# EAGLE design SB (EAGLE 9.6.1)

## Sheet 1 of 2
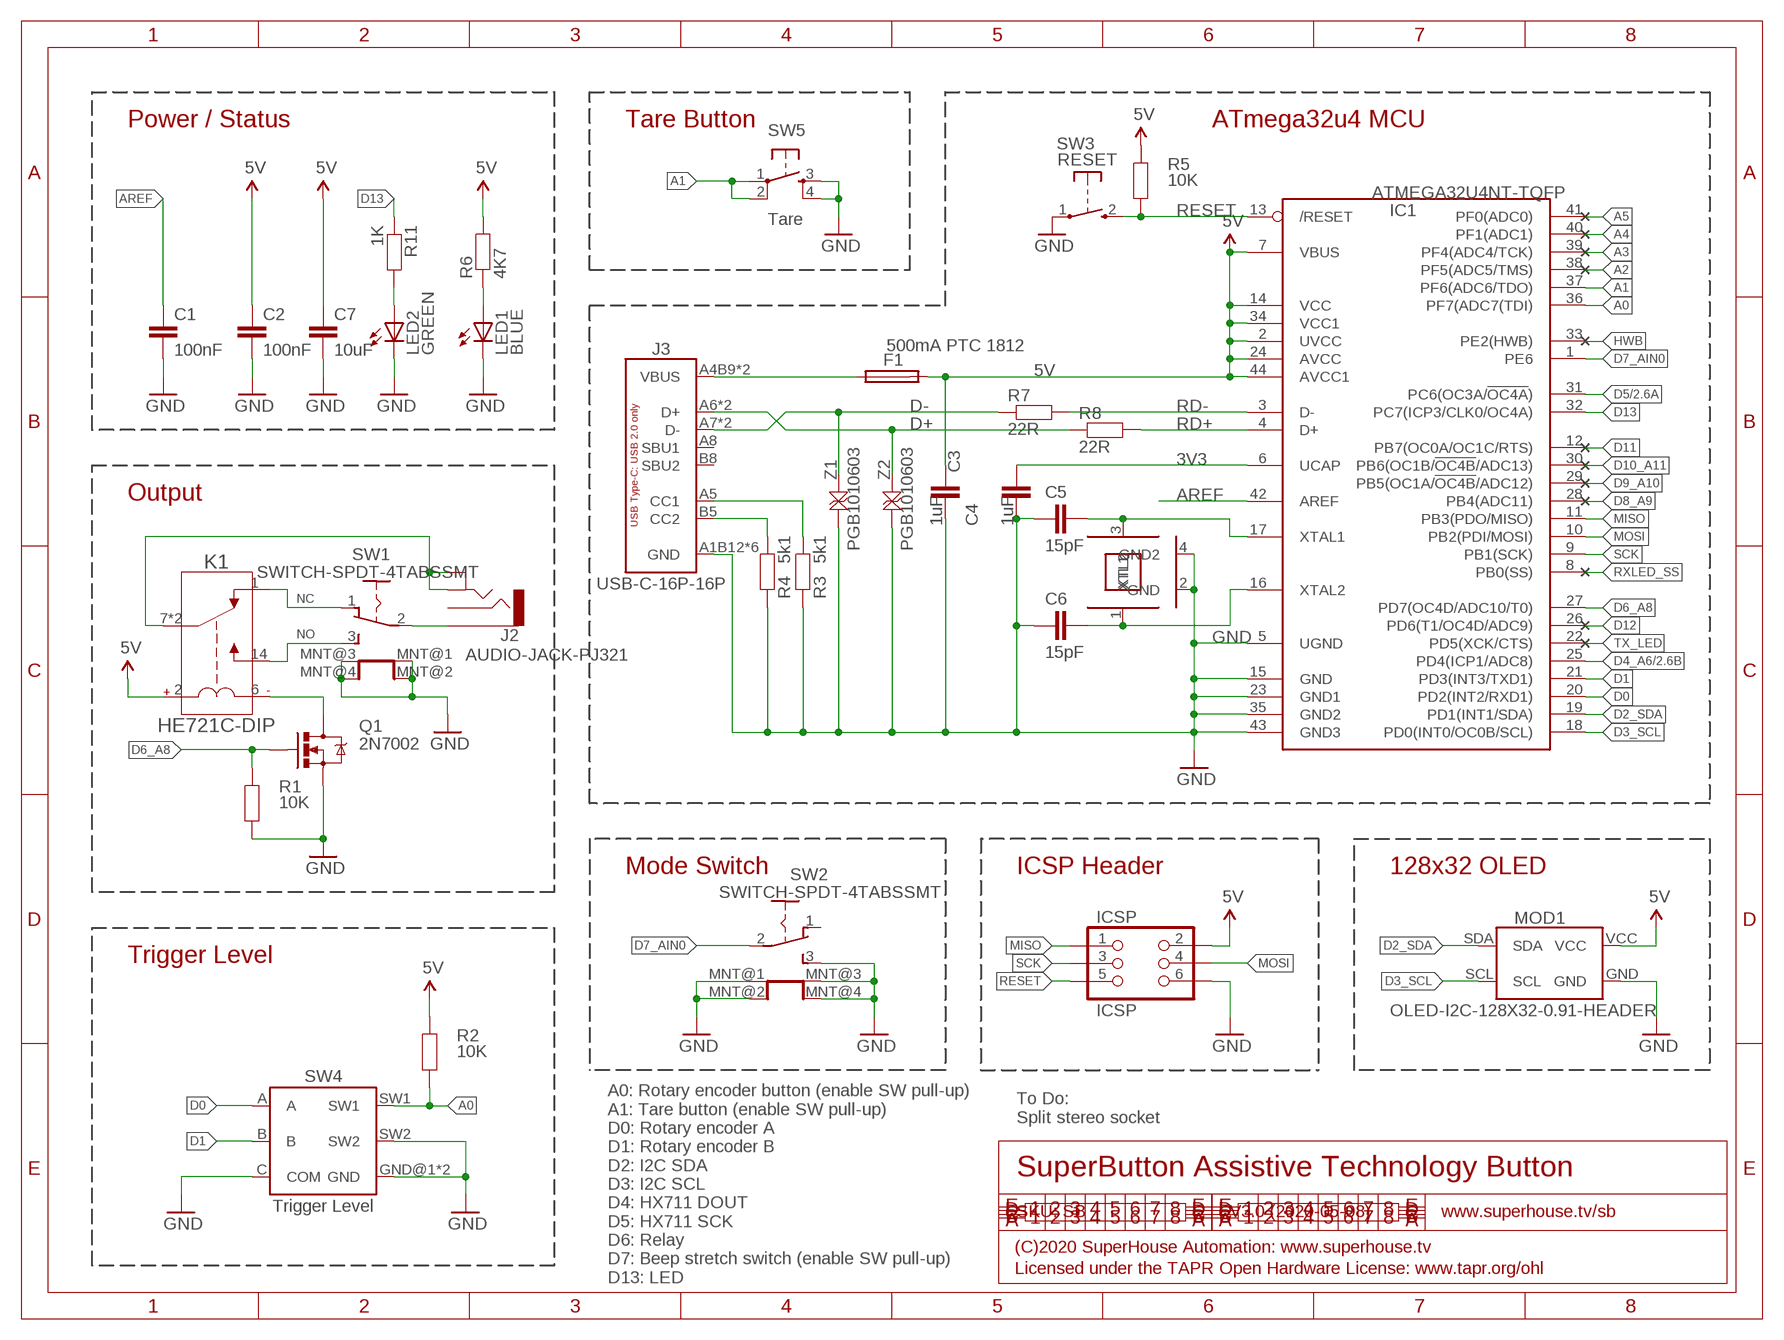
[diagram p0: schematic, sheet 1]

### Parts
C1  100nF  CAP0603  [C0603]
C2  100nF  CAP0603  [C0603]
C3  1uF  CAP0805  [C0805]
C4  1uF  CAP0805  [C0805]
C5  15pF  CAP0603  [C0603]
C6  15pF  CAP0603  [C0603]
C7  10uF  CAP0805  [C0805]
F1  500mA PTC 1812  PTC050  [1812]
IC1  ATMEGA32U4NT-TQFP  [TQFP44]
ICSP  ICSP  ICSP-PIN  [2X03-ICSP]
J2  AUDIO-JACK-PJ321  [AUDIO-JACK-PJ321]
J3  USB-C-16P-16P  [USB-C-16P]
K1  HE721C-DIP  [HE721]
LED1  BLUE  LED0603  [LED-0603]
LED2  GREEN  LED0603  [LED-0603]
MOD1  OLED-I2C-128X32-0.91-HEADER  [OLED-128X32-0.91-HEADER]
Q1  2N7002  MOSFET-NCHANNEL-233  [SOT23-3]
R1  10K  RESISTOR0603  [R0603]
R2  10K  RESISTOR0603  [R0603]
R3  5k1  RESISTOR0603  [R0603]
R4  5k1  RESISTOR0603  [R0603]
R5  10K  RESISTOR0603  [R0603]
R6  4K7  RESISTOR0603  [R0603]
R7  22R  RESISTOR0603  [R0603]
R8  22R  RESISTOR0603  [R0603]
R11  1K  RESISTOR0603  [R0603]
SW1  SWITCH-SPDT-4TABSSMT  [MK-12C02]
SW2  SWITCH-SPDT-4TABSSMT  [MK-12C02]
SW3  RESET  TAC_SWITCH_2PINSMT  [TACTILE_SMT_3X4X2]
SW4  Trigger Level  ENCODER  [PEC12R]
SW5  Tare  TAC_SWITCH-PTH-4.5  [TACTILE-PTH-4.5MM]
XTL1  16MHz  CRYSTAL-GND3X2  [CRYSTAL-SMD-3X2]
Z1  PGB1010603  TVS0603  [TVS0603]
Z2  PGB1010603  TVS0603  [TVS0603]

### Nets
3V3: C4.2 IC1.6(UCAP)
5V: C2.1 C3.1 C7.1 F1.2 IC1.2(UVCC) IC1.7(VBUS) IC1.14(VCC) IC1.24(AVCC) IC1.34(VCC1) IC1.44(AVCC1) ICSP.2 K1.2(COIL+) MOD1.VCC R2.2 R5.2 R6.2 ; also sheet 2
A0: IC1.36(PF7(ADC7(TDI)) R2.1 SW4.SW1
A1: IC1.37(PF6(ADC6/TDO)) SW5.1 SW5.2
A2: IC1.38(PF5(ADC5/TMS))
A3: IC1.39(PF4(ADC4/TCK))
A4: IC1.40(PF1(ADC1))
A5: IC1.41(PF0(ADC0))
AREF: C1.1 IC1.42(AREF)
D0: IC1.20(PD2(INT2/RXD1)) SW4.A
D1: IC1.21(PD3(INT3/TXD1)) SW4.B
D2_SDA: IC1.19(PD1(INT1/SDA)) MOD1.SDA
D3_SCL: IC1.18(PD0(INT0/OC0B/SCL)) MOD1.SCL
D4_A6: IC1.25(PD4(ICP1/ADC8)) ; also sheet 2
D5: IC1.31(PC6(OC3A/!OC4A!)) ; also sheet 2
D6_A8: IC1.27(PD7(OC4D/ADC10/T0)) Q1.1(G) R1.2
D7_AIN0: IC1.1(PE6) SW2.2(COM)
D8_A9: IC1.28(PB4(ADC11))
D9_A10: IC1.29(PB5(OC1A/!OC4B!/ADC12))
D10_A11: IC1.30(PB6(OC1B/!OC4B!/ADC13))
D11: IC1.12(PB7(OC0A/OC1C/RTS))
D12: IC1.26(PD6(T1/OC4D/ADC9))
D13: IC1.32(PC7(ICP3/CLK0/OC4A)) R11.1
D+: J3.A6(D+) J3.B6(D+) R8.1 Z2.2
D-: J3.A7(D-) J3.B7(D-) R7.1 Z1.2
GND: C1.2 C2.2 C3.2 C4.1 C5.1 C6.1 C7.2 IC1.5(UGND) IC1.15(GND) IC1.23(GND1) IC1.35(GND2) IC1.43(GND3) ICSP.6 J3.A1B12(GND) J3.A12B1(GND) J3.FIX1(GND) J3.FIX2(GND) J3.FIX3(GND) J3.FIX4(GND) LED1.C LED2.C MOD1.GND Q1.2(S) R1.1 R3.1 R4.1 SW1.MNT@1(MNT) SW1.MNT@2(MNT) SW1.MNT@3(MNT) SW1.MNT@4(MNT) SW2.3(B) SW2.MNT@1(MNT) SW2.MNT@2(MNT) SW2.MNT@3(MNT) SW2.MNT@4(MNT) SW3.1(P) SW4.C(COM) SW4.GND@1(GND) SW4.GND@2(GND) SW4.SW2 SW5.3 SW5.4 XTL1.2(GND) XTL1.4(GND2) Z1.1 Z2.1 ; also sheet 2
HWB: IC1.33(PE2(HWB))
MISO: IC1.11(PB3(PDO/MISO)) ICSP.1
MOSI: IC1.10(PB2(PDI/MOSI)) ICSP.4
N$1: LED2.A R11.2
N$3: K1.6(COIL-) Q1.3(D)
N$4: K1.14(NO) SW1.3(B)
N$5: LED1.A R6.1
N$6: K1.1(NC) SW1.1(A)
N$7: J2.4A J2.4B K1.7(COM) K1.8(COM)
N$9: J2.3 SW1.2(COM)
N$10: J3.B5(CC2) R4.2
N$11: C5.2 IC1.17(XTAL1) XTL1.3(XTL2)
N$12: C6.2 IC1.16(XTAL2) XTL1.1(XTL1)
N$13: J3.A5(CC1) R3.2
RD+: IC1.4(D+) R8.2
RD-: IC1.3(D-) R7.2
RESET: IC1.13(/RESET) ICSP.5 R5.1 SW3.2(S)
RXLED_SS: IC1.8(PB0(SS))
SCK: IC1.9(PB1(SCK)) ICSP.3
TX_LED: IC1.22(PD5(XCK/CTS))
USB+: F1.1 J3.A4B9(VBUS) J3.A9B4(VBUS)
Unconnected: J2.2 J3.A8(SBU1) J3.B8(SBU2) SW2.1(A)

### Notes on the sheet
- Power / Status | Tare Button | ATmega32u4 MCU
- Output
- NC
- NO
- Mode Switch | ICSP Header | 128x32 OLED
- Trigger Level
- To Do:
  Split stereo socket
- SuperButton Assistive Technology Button
- SKU: SB | V3.0 (2020-05-08) | www.superhouse.tv/sb
- (C)2020 SuperHouse Automation: www.superhouse.tv
- Licensed under the TAPR Open Hardware License: www.tapr.org/ohl
- A0: Rotary encoder button (enable SW pull-up)
  A1: Tare button (enable SW pull-up)
  D0: Rotary encoder A
  D1: Rotary encoder B
  D2: I2C SDA
  D3: I2C SCL
  D4: HX711 DOUT
  D5: HX711 SCK
  D6: Relay
  D7: Beep stretch switch (enable SW pull-up)
  D13: LED

## Sheet 2 of 2
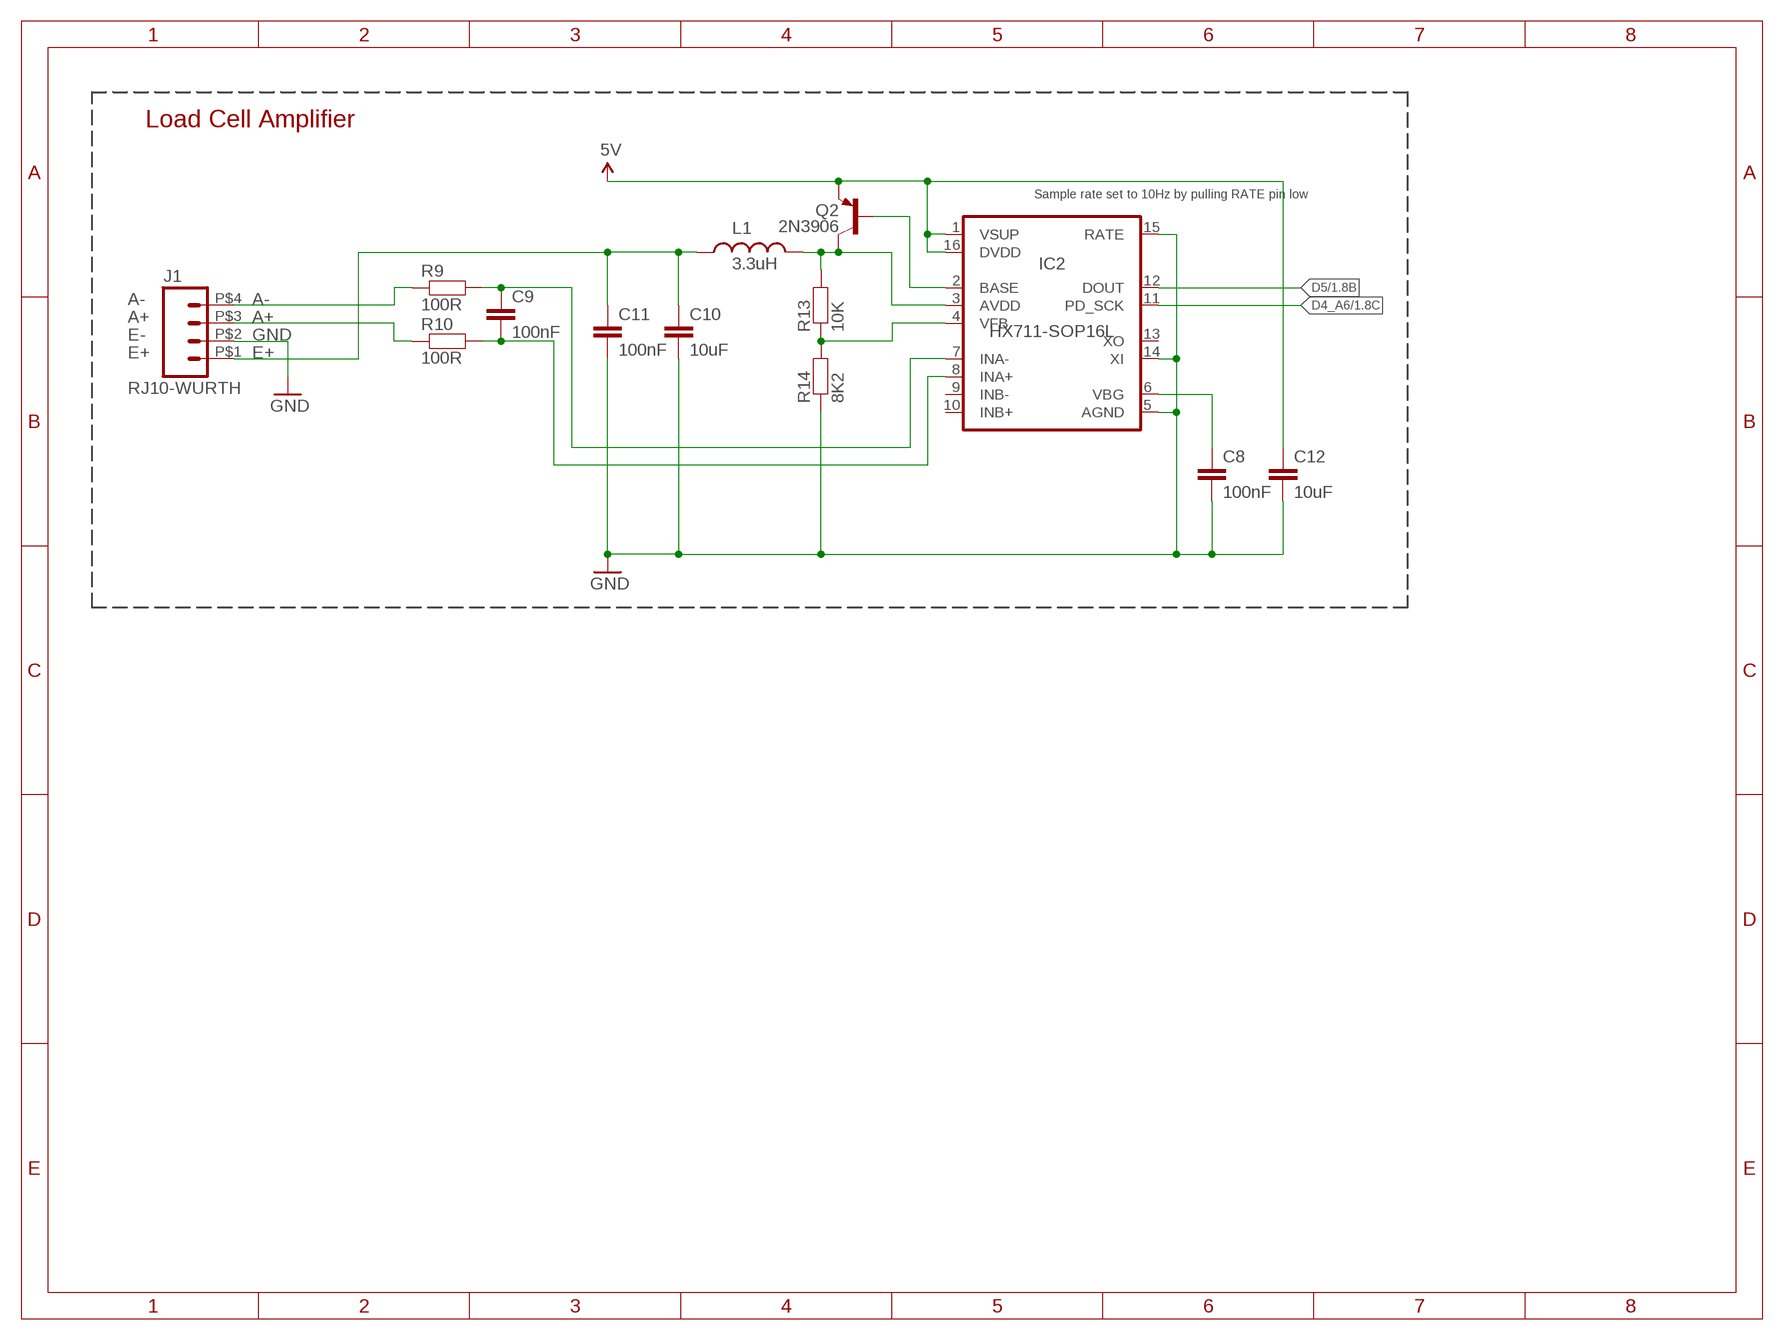
[diagram p1: schematic, sheet 2]

### Parts
C8  100nF  CAP0603  [C0603]
C9  100nF  CAP0603  [C0603]
C10  10uF  CAP0603  [C0603]
C11  100nF  CAP0603  [C0603]
C12  10uF  CAP0603  [C0603]
IC2  HX711-SOP16L  [SOP16-L]
J1  RJ10-WURTH  [RJ10]
L1  3.3uH  INDUCTOR0603  [L0603]
Q2  2N3906  TRANS_PNPMMBT3906LT1SOT23-BEC  [SOT23-BEC]
R9  100R  RESISTOR0603  [R0603]
R10  100R  RESISTOR0603  [R0603]
R13  10K  RESISTOR0603  [R0603]
R14  8K2  RESISTOR0603  [R0603]

### Nets
5V: C12.1 IC2.1(VSUP) IC2.16(DVDD) Q2.E ; also sheet 1
A+: J1.P$3 R10.1
A-: J1.P$4 R9.1
D4_A6: IC2.11(PD_SCK) ; also sheet 1
D5: IC2.12(DOUT) ; also sheet 1
E+: C10.1 C11.1 J1.P$1 L1.1
GND: C8.2 C10.2 C11.2 C12.2 IC2.5(AGND) IC2.14(XI) IC2.15(RATE) J1.P$2 R14.1 ; also sheet 1
N$14: C9.1 IC2.7(INA-) R9.2
N$15: C9.2 IC2.8(INA+) R10.2
N$16: IC2.3(AVDD) L1.2 Q2.C R13.2
N$17: C8.1 IC2.6(VBG)
N$20: IC2.2(BASE) Q2.B
N$21: IC2.4(VFB) R13.1 R14.2
Unconnected: IC2.9(INB-) IC2.10(INB+)

### Notes on the sheet
- Load Cell Amplifier
- Sample rate set to 10Hz by pulling RATE pin low
- A-
- A+
- E-
- E+

## Power pins joined to a net without a drawn wire
XO: IC2.13(XO)

## Library data of the parts
C1-C12 = SuperHouse-DiscreteSemi:CAP: Capacitor Standard ceramic capacitor
F1 = SuperHouse-Fuses:PTC: MF-SMDF Series - PRC Resettable Fuses Source: http://www.farnell.com/datasheets/716597.pdf
IC1 = SuperHouse-MCUs:ATMEGA32U4NT: ATmega32u4 MCU
IC2 = SuperHouse-ICs:HX711: HX711 strain gauge amplifier
ICSP = SuperHouse-Connectors:ICSP
J1 = SuperHouse-Connectors:RJ10: RJ10 jack (4P4C)
J2 = SuperHouse-Connectors:AUDIO-JACK-PJ321
J3 = SuperHouse-Connectors:USB-C-16P: USB-C socket with 16 pins, suitable only for backward compatibility with USB 2
K1 = SuperHouse-Relays:HE721C
L1 = SuperHouse-DiscreteSemi:INDUCTOR: Inductors Basic Inductor/Choke - 0603 and 1206. Footprints are not proven and vary greatly between part numbers.
LED1 LED2 = SuperHouse-LEDs:LED: LEDs Standard schematic elements and footprints for 5mm, 3mm, 1206, and 0603 sized LEDs. 5mm - Spark Fun Electronics SKU : COM-00529 (and others)
MOD1 = SuperHouse-Displays:OLED-I2C: OLED module with SSD1306 I2C driver
Q1 = SuperHouse-DiscreteSemi:MOSFET-NCHANNEL: N-channel MOSFET
Q2 = SuperHouse-DiscreteSemi:TRANS_PNP: PNP Transistror
R1-R11 R13 R14 = SuperHouse-DiscreteSemi:RESISTOR: Resistor Standard resistors.
SW1 SW2 = SuperHouse-Switches:SWITCH-SPDT-4TABS
SW3 = SuperHouse-Switches:TAC_SWITCH_2PIN: Momentary Tactile Switch - 2 pin Uxcell 3x4x2mm switch with 2 SMT pads
SW4 = SuperHouse-Switches:ENCODER: Rotary encoder with switch
SW5 = SuperHouse-Switches:TAC_SWITCH: Momentary Switch Tactile switch, normally-open.
XTL1 = SuperHouse-Oscillators:CRYSTAL-GND: 3x2mm SMT crystal
Z1 Z2 = SuperHouse-DiscreteSemi:TVS: TVS voltage protection Zener

## Board
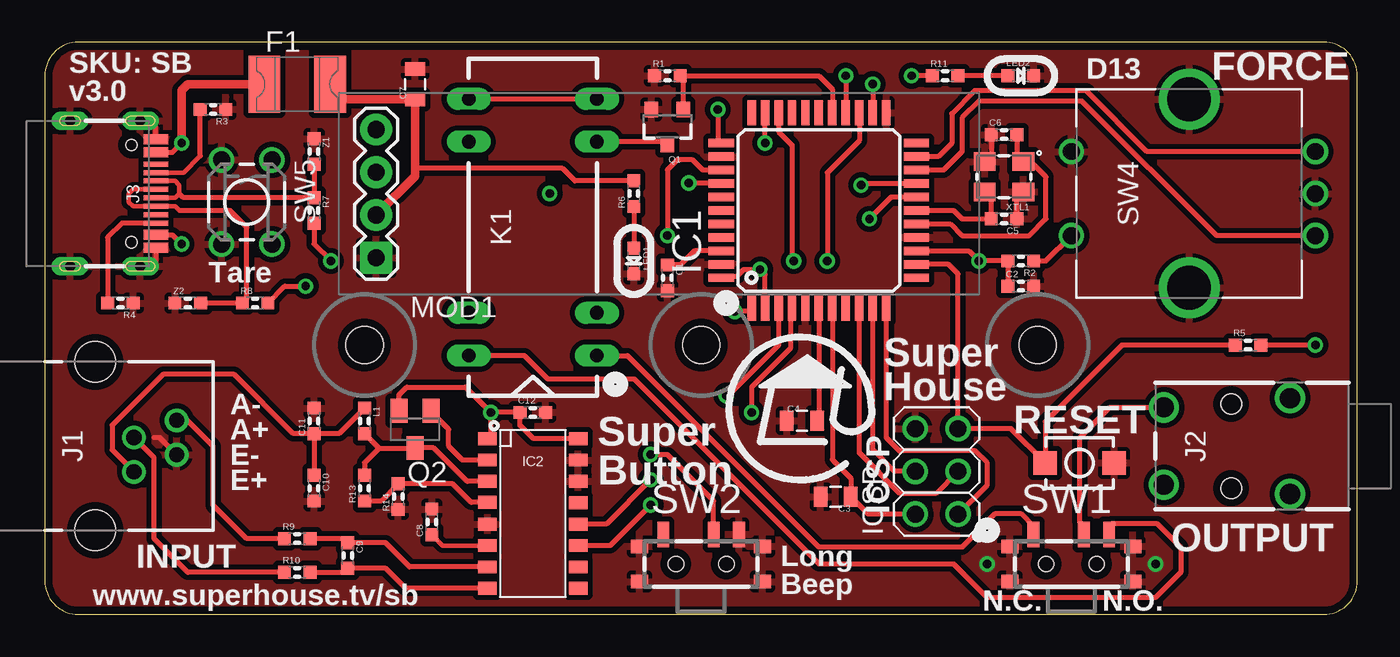
[diagram p2: board, top side]
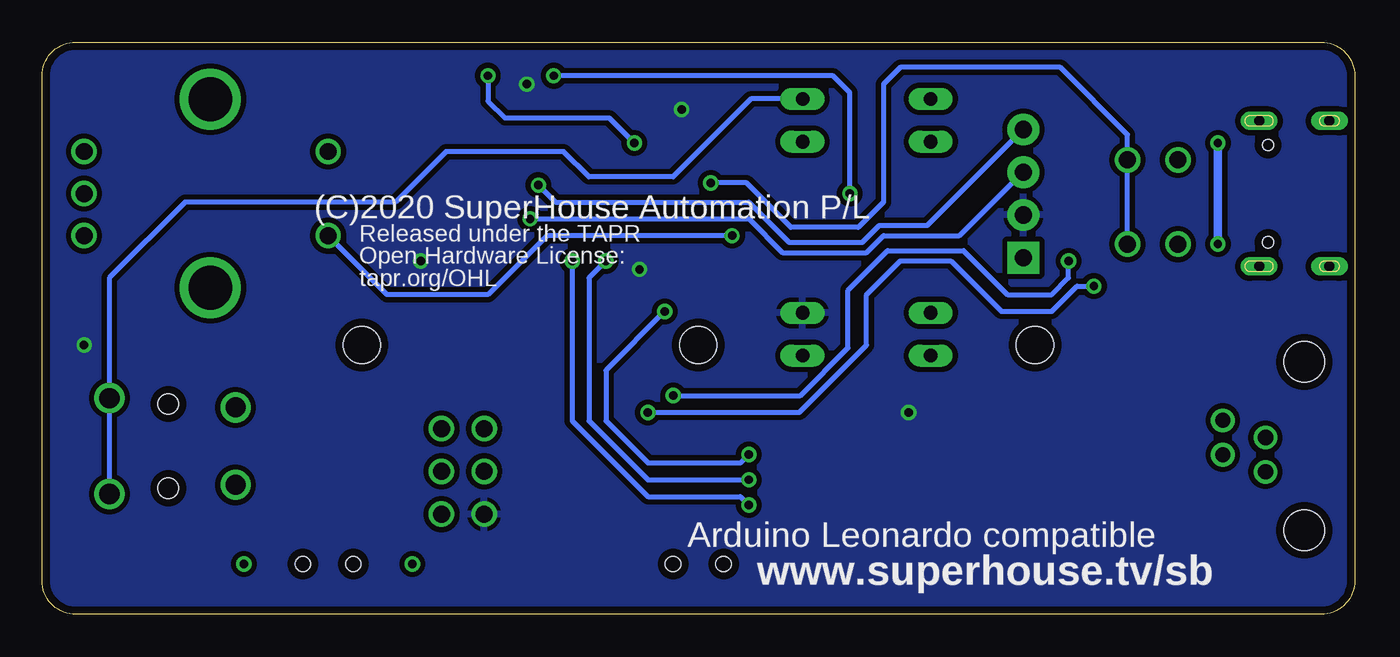
[diagram p3: board, bottom side, seen from below]

Size 78 x 34 mm. Coordinates in mm from the lower left corner, seen from the top.
Outline: 76,34 2,34 arc90 0,32 0,2 arc90 2,0 76,0 arc90 78,2 78,32 arc90 76,34
Copper layers (1*16): Top 0.035mm / dielectric 1.5mm / Bottom 0.035mm
Design rules "default *": minimum track width 10mil, minimum drill 24mil, track to track 12mil, track to pad 12mil, pad to pad 12mil, via to via 12mil, smd to smd 8mil, copper to edge 18mil, drill to drill 8mil, minimum pad ring 10mil, minimum via ring 8mil, stop-mask expansion 4mil, vias tented up to drill 0mil, thermal gap 10mil
Holes 2.2 mm at 39,16 19,16 59,16

### Footprints (pad centres in the part's own frame; a part is rotated, then mirrored left to right if it is on the bottom)
C0603 = smd 0.762 x 0.762: 1 -0.762,0; 2 0.762,0
C0805 = smd 0.8 x 1.2: 1 -0.9,0; 2 0.9,0
1812 = smd 1.9 x 3.4: 1 -1.95,0; 2 1.95,0
TQFP44 = smd 1.5 x 0.5: 1 -5.8,4; 2 -5.8,3.2; 3 -5.8,2.4; 4 -5.8,1.6; 5 -5.8,0.8; 6 -5.8,0; 7 -5.8,-0.8; 8 -5.8,-1.6; 9 -5.8,-2.4; 10 -5.8,-3.2; 11 -5.8,-4; 23 5.8,-4; 24 5.8,-3.2; 25 5.8,-2.4; 26 5.8,-1.6; 27 5.8,-0.8; 28 5.8,0; 29 5.8,0.8; 30 5.8,1.6; 31 5.8,2.4; 32 5.8,3.2; 33 5.8,4 | smd 0.5 x 1.5: 12 -4,-5.8; 13 -3.2,-5.8; 14 -2.4,-5.8; 15 -1.6,-5.8; 16 -0.8,-5.8; 17 0,-5.8; 18 0.8,-5.8; 19 1.6,-5.8; 20 2.4,-5.8; 21 3.2,-5.8; 22 4,-5.8; 34 4,5.8; 35 3.2,5.8; 36 2.4,5.8; 37 1.6,5.8; 38 0.8,5.8; 39 0,5.8; 40 -0.8,5.8; 41 -1.6,5.8; 42 -2.4,5.8; 43 -3.2,5.8; 44 -4,5.8
SOP16-L = smd 1.1 x 0.76: 1 -2.7,4.445; 2 -2.7,3.175; 3 -2.7,1.905; 4 -2.7,0.66; 5 -2.7,-0.635; 6 -2.7,-1.905; 7 -2.7,-3.175; 8 -2.7,-4.445; 9 2.7,-4.445; 10 2.7,-3.175; 11 2.7,-1.905; 12 2.7,-0.635; 13 2.7,0.635; 14 2.7,1.905; 15 2.7,3.175; 16 2.7,4.445
2X03-ICSP = drill 1.016: 1 -2.54,-1.27; 2 -2.54,1.27; 3 0,-1.27; 4 0,1.27; 5 2.54,-1.27; 6 2.54,1.27
RJ10 = drill 0.9: P$1 1.53,2.3; P$2 0.51,4.84; P$3 -0.51,2.3; P$4 -1.53,4.84 | hole 2.4: -5,0; 5,0
AUDIO-JACK-PJ321 = drill 1.2: 2 -2.3,7.5; 3 2.3,7.5; 4A -2.85,0; 4B 2.85,0 | hole 1.2: -2.5,3.5; 2.5,3.5
USB-C-16P = smd 0.6 x 1.45: A1B12 -3.225,5.095; A4B9 -2.45,5.095; A9B4 2.45,5.095; A12B1 3.225,5.095 | smd 0.3 x 1.45: A5 -1.25,5.095; A6 -0.25,5.095; A7 0.25,5.095; A8 1.25,5.095; B5 1.75,5.095; B6 0.75,5.095; B7 -0.75,5.095; B8 -1.75,5.095 | drill 0.6 pad 0.8 long: FIX1 -4.32,0; FIX4 4.32,0 | drill 0.6 pad 1 long: FIX2 -4.32,4.18; FIX3 4.32,4.18 | hole 0.65: 2.89,3.65; -2.89,3.65
HE721 = drill 0.813 long: 1 -7.62,-3.81; 2 -5.08,-3.81; 6 5.08,-3.81; 7 7.62,-3.81; 8 7.62,3.81; 9 5.08,3.81; 13 -5.08,3.81; 14 -7.62,3.81
L0603 = smd 0.762 x 0.762: 1 -0.762,0; 2 0.762,0
LED-0603 = smd 0.762 x 0.762: A -0.762,0; C 0.762,0
OLED-128X32-0.91-HEADER = drill 1.016 pad 1.88 square: GND -18.31,-3.81 | drill 1.016 pad 1.88: SCL -18.31,1.27; SDA -18.31,3.81; VCC -18.31,-1.27
SOT23-3 = smd 0.8 x 0.9: 1 -0.95,-1; 2 0.95,-1; 3 0,1.1
SOT23-BEC = smd 1 x 1.4: B -0.95,-1.1; C 0,1.1; E 0.95,-1.1
R0603 = smd 0.762 x 0.762: 1 -0.762,0; 2 0.762,0
MK-12C02 = smd 0.7 x 1.5: 1 -2.25,1.75; 2 0.75,1.75; 3 2.25,1.75 | smd 1 x 0.8: MNT@1 -3.65,1.05; MNT@2 -3.65,-1.05; MNT@3 3.65,1.05; MNT@4 3.65,-1.05 | hole 0.9: -1.5,0; 1.5,0
TACTILE_SMT_3X4X2 = smd 1.4 x 1.4: 1 -2.05,0; 2 2.05,0
PEC12R = drill 1: A -2.5,-7.5; B 2.5,-7.5; C 0,-7.5; SW1 -2.5,7; SW2 2.5,7 | drill 2.6: GND@1 -5.6,0; GND@2 5.6,0
TACTILE-PTH-4.5MM = drill 1.016: 1 -2.5,1.5; 2 2.5,1.5; 3 -2.5,-1.5; 4 2.5,-1.5
CRYSTAL-SMD-3X2 = smd 1.3 x 1.1: 1 -1.15,-0.9; 2 1.15,-0.9; 3 1.15,0.9; 4 -1.15,0.9
TVS0603 = smd 0.762 x 0.762: 1 -0.762,0; 2 0.762,0

### Placement (x,y rotation side)
C1  37,20 270 top
C2  58,19.5 0 top
C3  47,7 180 top
C4  45,11.5 0 top
C5  57,23.5 180 top
C6  57,28.5 0 top
C7  22,31.5 90 top
C8  23,5.5 90 top
C9  18,3.5 270 top
C10  16,7.5 270 top
C11  16,11.5 90 top
C12  29,12 0 top
F1  15,31.5 0 top
IC1  46,24 90 top
IC2  29,6 0 top
ICSP  53,8.5 90 top
J1  3,10 270 top
J2  74,10 90 top
J3  1.5,25 270 top
K1  29,23 90 top
L1  19,11.5 270 top
LED1  35,21 270 top
LED2  58,32 0 top
MOD1  38,25 0 top
Q1  37,29 180 top
Q2  22,11 180 top
R1  37,32 0 top
R2  58,21 180 top
R3  10,30 180 top
R4  4.5,18.5 180 top
R5  71.5,16 0 top
R6  35,25 90 top
R7  16,24 270 top
R8  12.5,18.5 0 top
R9  15,4.5 0 top
R10  15,2.5 0 top
R11  53.5,32 0 top
R13  19,7.5 90 top
R14  21,7 90 top
SW1  61,3 0 top
SW2  39,3 0 top
SW3  61.5,9 180 top
SW4  68,25 90 top
SW5  12,24.5 270 top
XTL1  57,26 180 top
Z1  16,27.5 270 top
Z2  8.5,18.5 0 top

### Tracks (layer width: path | path; a pad name or v marks a point on that pad's centre or on a via)
3V3
  Top 0.305: C4.2 46,11.74 IC1.6
5V  (via drill 0.5)
  Top 0.254: 26.36,10.5 IC2.1 26.5,10.64
  Top 0.305: v40,30 40,28.2 IC1.34 | v49.2,31.5 IC1.24 | IC1.14 54.9,21.6 v55.5,21 R2.2 C2.1 | IC1.44 40.29,20.09 41.14,20.09 41.55,20.5 v42.5,20.5 42.8,20.2 IC1.2 | v75.5,16 R5.2 | IC2.16 29.03,10.45 28.24,11.24 C12.1 v26.5,12 | v26.5,12 26.5,10.64 | Q2.E 21.05,13.05 21.5,13.5 25,13.5 v26.5,12 | IC1.7 46.8,9.2 47.9,8.1 C3.1 48.94,5.96 ICSP.2 | 22,26.5 30.76,26.5 31.5,25.76 R6.2
  Top 0.508: F1.2 16.5,31.05 16.5,30.5 16.6,30.6 C7.1 22,26.5 22,26.04 MOD1.VCC
  pour Bottom: 76,0 2,0 arc-90 0,2 0,32 arc-90 2,34 76,34 arc-90 78,32 78,2 arc-90
A0  (via drill 0.5)
  Top 0.305: v37,22.5 37,26.4 37.6,27 38.5,27 39.1,26.4 IC1.36 | R2.1 59.5,21 SW4.SW1
  Bottom 0.305: v37,22.5 48,22.5 51.5,19 57.5,19 SW4.SW1
A1  (via drill 0.5)
  Top 0.305: IC1.37 38.31,25.6 v38.27,25.64
  Bottom 0.305: SW5.2 SW5.1 13.5,28.5 17.5,32.5 27,32.5 28,31.5 28,24.5 29.5,23 33.5,23 36.14,25.64 v38.27,25.64
A+
  Top 0.305: R10.1 8.5,2.5 6.5,4.5 6.5,9.31 J1.P$3
A-
  Top 0.305: R9.1 12,4.5 10,6.5 10,10 8.47,11.53 J1.P$4
AREF
  Top 0.305: IC1.42 38.6,21.6 37.76,20.76 C1.1
D0
  Top 0.305: SW4.A 69.64,22.5 61.64,30.5 55.5,30.5 54.5,29.5 54.5,27.5 53.4,26.4 IC1.20
D1
  Top 0.305: SW4.B 65.5,27.5 61.89,31.11 55.25,31.11 53.89,29.75 53.89,28 53.09,27.2 IC1.21
D2_SDA  (via drill 0.5)
  Top 0.305: v48.5,25.5 48.6,25.6 IC1.19
  Bottom 0.305: v48.5,25.5 47.5,24.5 36,24.5 33.61,22.11 29.25,22.11 28.25,23.11 25.39,23.11 MOD1.SDA
D3_SCL  (via drill 0.5)
  Top 0.305: v49,23.5 50.3,24.8 IC1.18
  Bottom 0.305: v49,23.5 36,23.5 34,21.5 29,21.5 28,22.5 23.5,22.5 19.73,26.27 MOD1.SCL
D4_A6  (via drill 0.5)
  Top 0.305: IC1.25 48.4,28.15 46.5,26.25 v46.5,21 | v36,6.5 33.59,4.09 IC2.11
  Bottom 0.305: v46.5,21 46.5,11.5 42,7 36.5,7 v36,6.5
D5  (via drill 0.5)
  Top 0.305: IC1.31 43.6,28.69 44.41,27.88 44.41,21.09 v44.5,21 | v36,8 33.37,5.37 IC2.12
  Bottom 0.305: v44.5,21 45.5,20 45.5,11.5 42,8 v36,8
D6_A8
  Top 0.254: 37.95,31.81 R1.2
  Top 0.305: Q1.1 37.95,31.81 | R1.2 46,32 46.8,31.2 IC1.27
D7_AIN0  (via drill 0.5)
  Top 0.254: IC1.1 41.8,18
  Top 0.305: SW2.2 39.75,6.75 37,9.5 v36,9.5 | 41.8,18 v41,18
  Bottom 0.305: v36,9.5 36.5,9 42,9 44.5,11.5 44.5,14.5 v41,18
D12  (via drill 0.5)
  Top 0.305: v47.6,32 47.6,31.9 IC1.26
  Bottom 0.305: v30,25 30,31 31,32 v47.6,32
D13  (via drill 0.5)
  Top 0.305: R11.1 v51.5,32 | v42.8,28 IC1.32
  Bottom 0.305: v51.5,32 51.5,30.5 50.5,29.5 44.3,29.5 v42.8,28
D+
  Top 0.254: J3.A6 5.25,25.25 5,25 5,24.5 5.25,24.25 J3.B6 7.75,24.25 8,24
  Top 0.305: 8,24 11,24 12,23 12,18.76 R8.1 Z2.2
D-
  Top 0.254: J3.A7 7.75,24.75 8,25 8,25.5 7.75,25.75 J3.B7
  Top 0.305: Z1.2 R7.1 8.24,24.76 8,25
E+
  Top 0.305: L1.1 17.48,10.74 C11.1 | C11.1 C10.1 | C11.1 14.76,10.74 11.24,14.26 7.02,14.26 4,11.24 4,9.77 J1.P$1
GND  (via drill 0.5)
  Top 0.305: C5.1 57.76,24.71 XTL1.4 | C6.1 56.24,27.29 XTL1.2 | J3.A1B12 6.59,29.32 J3.FIX2 | J3.A12B1 6.59,20.68 J3.FIX3 | J1.P$2 6.83,10.5 6.5,10.5
  other vias: 56,3 66,3
  pour Top: 76,0 2,0 arc-90 0,2 0,32 arc-90 2,34 76,34 arc-90 78,32 78,2 arc-90
MISO
  Top 0.305: ICSP.1 56,7.69 56,9 55.28,9.72 50.78,9.72 50,10.5 IC1.11
MOSI
  Top 0.305: ICSP.4 50.5,8.5 49.2,9.8 IC1.10
N$1
  Top 0.305: LED2.A R11.2
N$3
  Top 0.254: Q1.3 36.82,28.08
  Top 0.305: 36.82,28.08 K1.6
N$4
  Top 0.305: K1.14 28.5,15.38 29.88,14 35,14 46,3 54,3 56,1 66,1 67.5,2.5 67.5,4 66.12,5.38 63.38,5.38 63.25,5.25 SW1.3
N$5
  Top 0.305: R6.1 LED1.A
N$6
  Top 0.305: K1.1 34.62,15.38 46,4 54.5,4 56.5,6 58,6 58.75,5.25 SW1.1
N$7
  Top 0.305: K1.8 K1.7
  Bottom 0.305: K1.7 35.88,30.62 40.5,26 45.5,26 47,27.5 54,27.5 57,24.5 69.5,24.5 74,20 J2.4B J2.4A
N$9
  Top 0.305: J2.3 63.3,12.3 61.5,10.5 61.5,5.5 61.75,5.25 SW1.2
N$10
  Top 0.305: J3.B5 4.59,23.25 3.74,22.39 R4.2
N$11
  Top 0.305: XTL1.3 56.24,24.71 C5.2 54.5,23.5 54,24 IC1.17
N$12
  Top 0.305: C6.2 57.76,27.29 XTL1.1 58.6,26.9 59.5,26 59.5,23.5 58.5,22.5 54.5,22.5 53.8,23.2 IC1.16
N$13
  Top 0.254: J3.A5 8.25,26.25 9.24,27.24
  Top 0.305: 9.24,27.24 R3.2
N$14
  Top 0.254: C9.1 17.76,4.5
  Top 0.305: 17.76,4.5 R9.2 | IC2.7 21.68,2.83 20.24,4.26 C9.1
N$15
  Top 0.254: 17.76,2.5 C9.2
  Top 0.305: R10.2 17.76,2.5 | IC2.8 21.45,1.55 20.26,2.74 C9.2
N$16
  Top 0.305: IC2.3 25.09,7.91 23.1,9.9 Q2.C 21.98,9.88 19.86,9.88 | 19.86,9.88 L1.2 | 19.86,9.88 19,9.02 R13.2
N$17
  Top 0.254: IC2.6 23.64,4.09 C8.1
N$20
  Top 0.254: 22.95,12.05 Q2.B
  Top 0.305: IC2.2 24.82,9.18 24,10 24,11 22.95,12.05
N$21
  Top 0.305: R13.1 19.98,6.74 R14.2 24.24,7.76 25.34,6.66 IC2.4
RD+  (via drill 0.5)
  Top 0.305: IC1.4 44.31,18.11 44.31,15.81 42,13.5 v42,12 | R8.2 14.26,19.5 v15.5,19.5
  Bottom 0.305: v15.5,19.5 16.5,19.5 18,18 21,18 24,21 27,21 29,19 29,16 33,12 v42,12
RD-  (via drill 0.5)
  Top 0.305: IC1.3 43.6,16 43.3,15.7 40.6,13 v40.5,13 | v17,21 16,22 R7.2
  Bottom 0.305: v40.5,13 32.95,13 30.11,15.84 30.11,19.25 27.75,21.61 23.25,21.61 20.64,19 18,19 17,20 v17,21
RESET
  Top 0.305: IC1.13 53.7,20.8 54.27,20.23 ICSP.5 57.41,11.04 SW3.2 59.45,11.45 64,16 R5.1
SCK
  Top 0.305: ICSP.3 52.95,7.18 50.82,7.18 48.4,9.6 IC1.9
USB+  (via drill 0.5)
  Top 0.305: v8.13,28 7.58,27.45 J3.A4B9 | v8.13,22 7.58,22.55 J3.A9B4
  Top 0.508: F1.1 8.5,31.5 8.13,31.13 v8.13,28
  Bottom 0.508: v8.13,28 v8.13,22

### Text on the board
tPlace: D13 | FORCE | SKU: SB / v3.0 | Tare | Super / House | A- | A+ | RESET | E- | E+ | Super / Button | ICSP | OUTPUT | INPUT | www.superhouse.tv/sb | Long / Beep | N.C. | N.O.
bPlace: (C)2020 SuperHouse Automation P/L | Released under the TAPR / Open Hardware License: / tapr.org/OHL | Arduino Leonardo compatible | www.superhouse.tv/sb